# EAGLE design BaseMachine_Sequencer_UI (EAGLE 7.2.0)
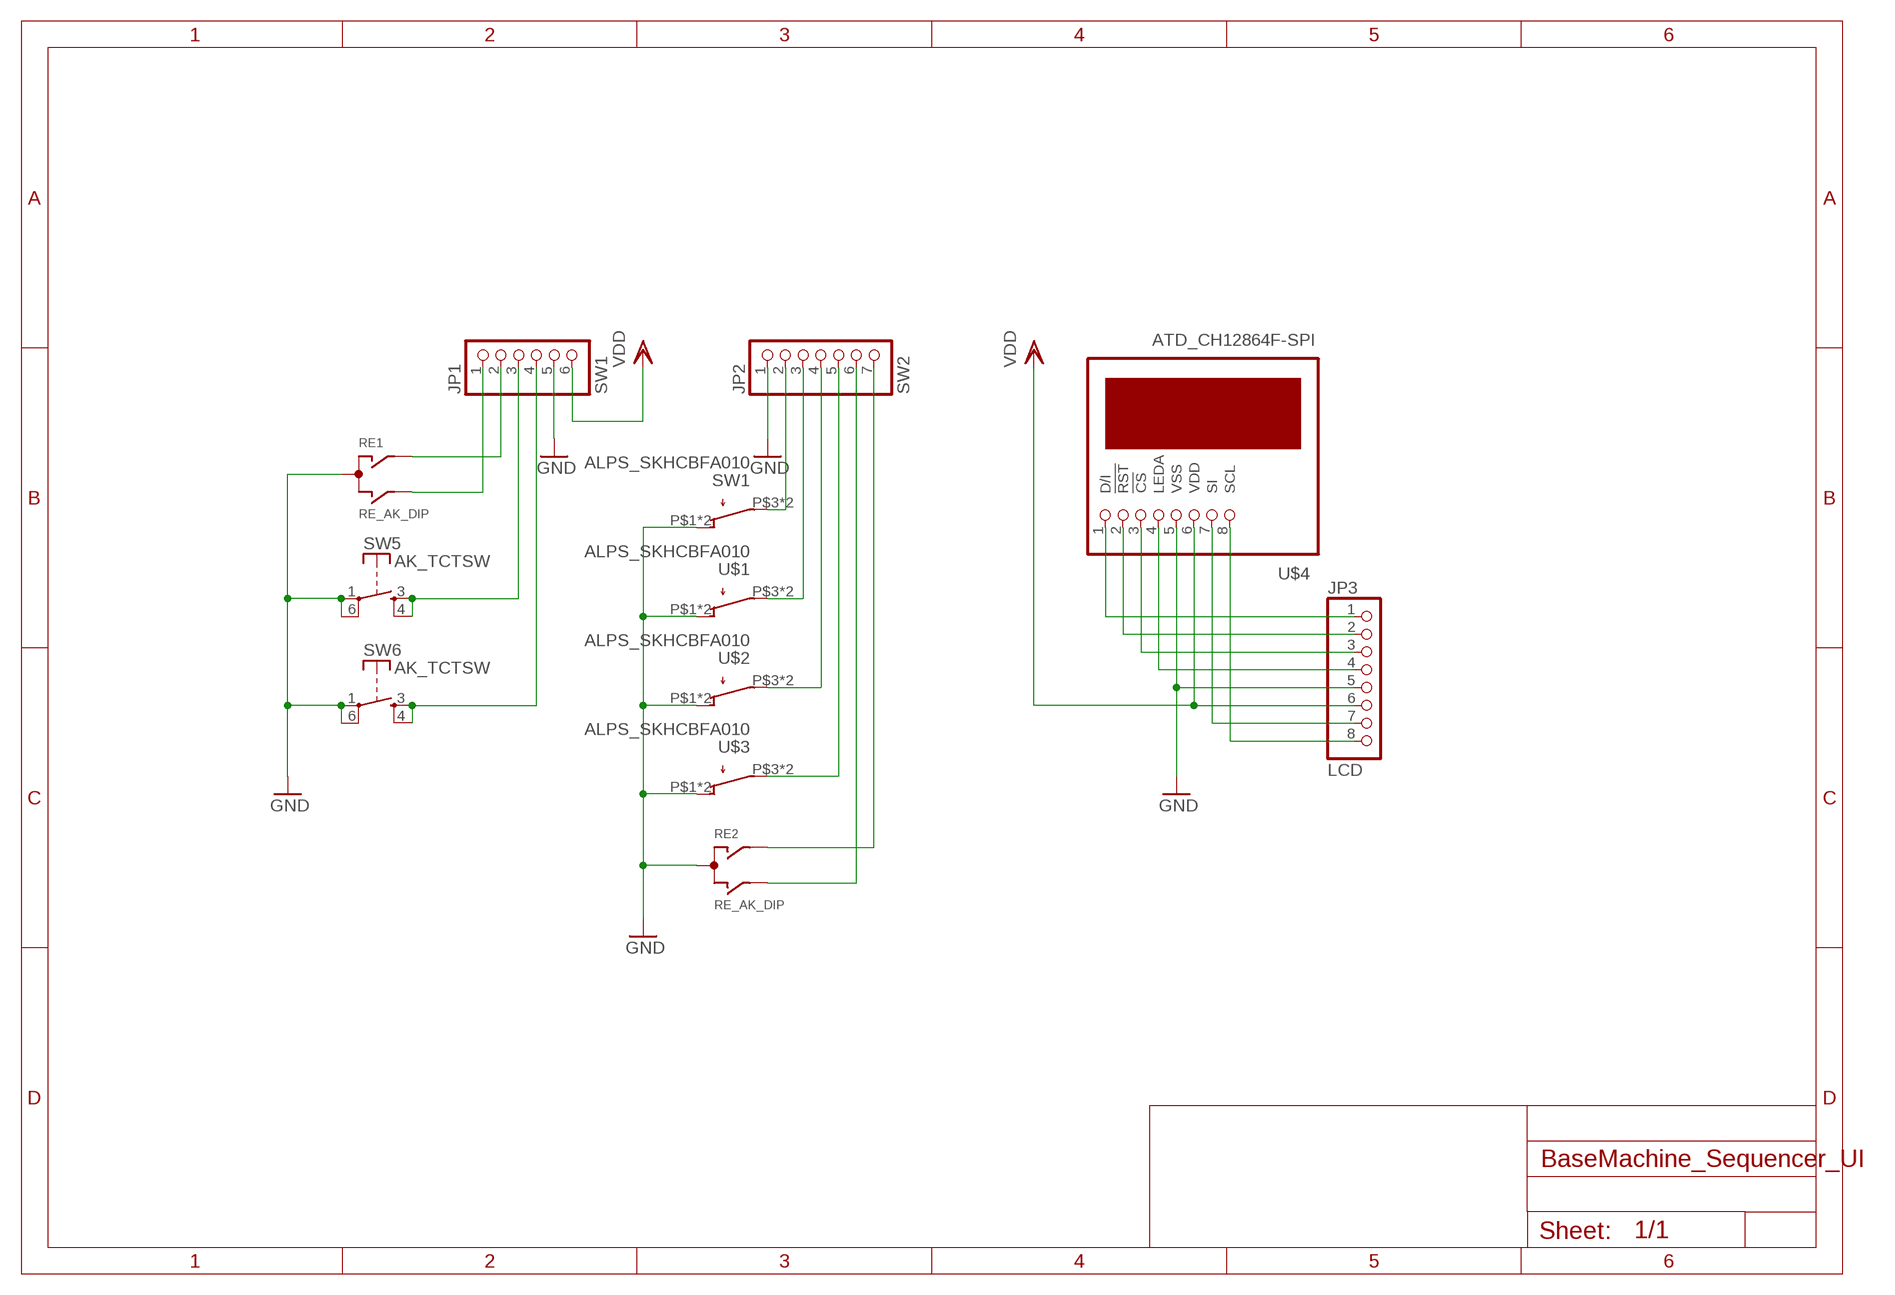
[diagram p0: schematic, sheet 1]

## Parts
JP1  SW1  PINHD-1X6/90  [1X06/90]
JP2  SW2  PINHD-1X7/90  [1X07/90]
JP3  LCD  PINHD-1X8/90  [1X08/90]
RE1  RE_AK_DIP  [RE_AK_DIP]
RE2  RE_AK_DIP  [RE_AK_DIP]
SW1  ALPS_SKHCBFA010  [ALPS_SKHCBFA010]
SW5  AK_TCTSW  [TME1]
SW6  AK_TCTSW  [TME1]
U$1  ALPS_SKHCBFA010  [ALPS_SKHCBFA010]
U$2  ALPS_SKHCBFA010  [ALPS_SKHCBFA010]
U$3  ALPS_SKHCBFA010  [ALPS_SKHCBFA010]
U$4  ATD_CH12864F-SPI  [ATD-CH12864F-SPI]

## Nets
GND: JP1.5 JP2.1 JP3.5 RE1.P$3(C) RE2.P$3(C) SW1.P$1(O) SW1.P$2(O) SW5.1(P) SW5.6(P) SW6.1(P) SW6.6(P) U$1.P$1(O) U$1.P$2(O) U$2.P$1(O) U$2.P$2(O) U$3.P$1(O) U$3.P$2(O) U$4.5(VSS)
LCD1: JP3.1 U$4.1(D/I)
N$2: JP2.4 U$2.P$3(P) U$2.P$4(P)
N$3: JP2.7 RE2.P$2(A)
N$4: JP2.2 SW1.P$3(P) SW1.P$4(P)
N$5: JP3.3 U$4.3(!CS)
N$6: JP2.3 U$1.P$3(P) U$1.P$4(P)
N$7: JP2.6 RE2.P$4(B)
N$8: JP2.5 U$3.P$3(P) U$3.P$4(P)
N$9: JP3.4 U$4.4(LEDA)
N$10: JP1.1 RE1.P$4(B)
N$12: JP1.3 SW5.3(S) SW5.4(S)
N$13: JP1.2 RE1.P$2(A)
N$17: JP3.2 U$4.2(!RST)
N$19: JP1.4 SW6.3(S) SW6.4(S)
N$22: JP3.7 U$4.7(SI)
N$23: JP3.8 U$4.8(SCL)
VDD: JP1.6 JP3.6 U$4.6(VDD)

## Library data of the parts
JP1 = pinhead:PINHD-1X6: PIN HEADER
JP2 = pinhead:PINHD-1X7: PIN HEADER
JP3 = pinhead:PINHD-1X8: PIN HEADER
RE1 RE2 = mylib2:RE_AK_DIP: 秋月 Rotary Encoder DIP化
SW1 U$1-U$3 = mylib2:ALPS_SKHCBFA010: ALPS Tact SW 12mm
SW5 SW6 = mylib2:AK_TCTSW
U$4 = mylib2:ATD_CH12864F-SPI

## Board
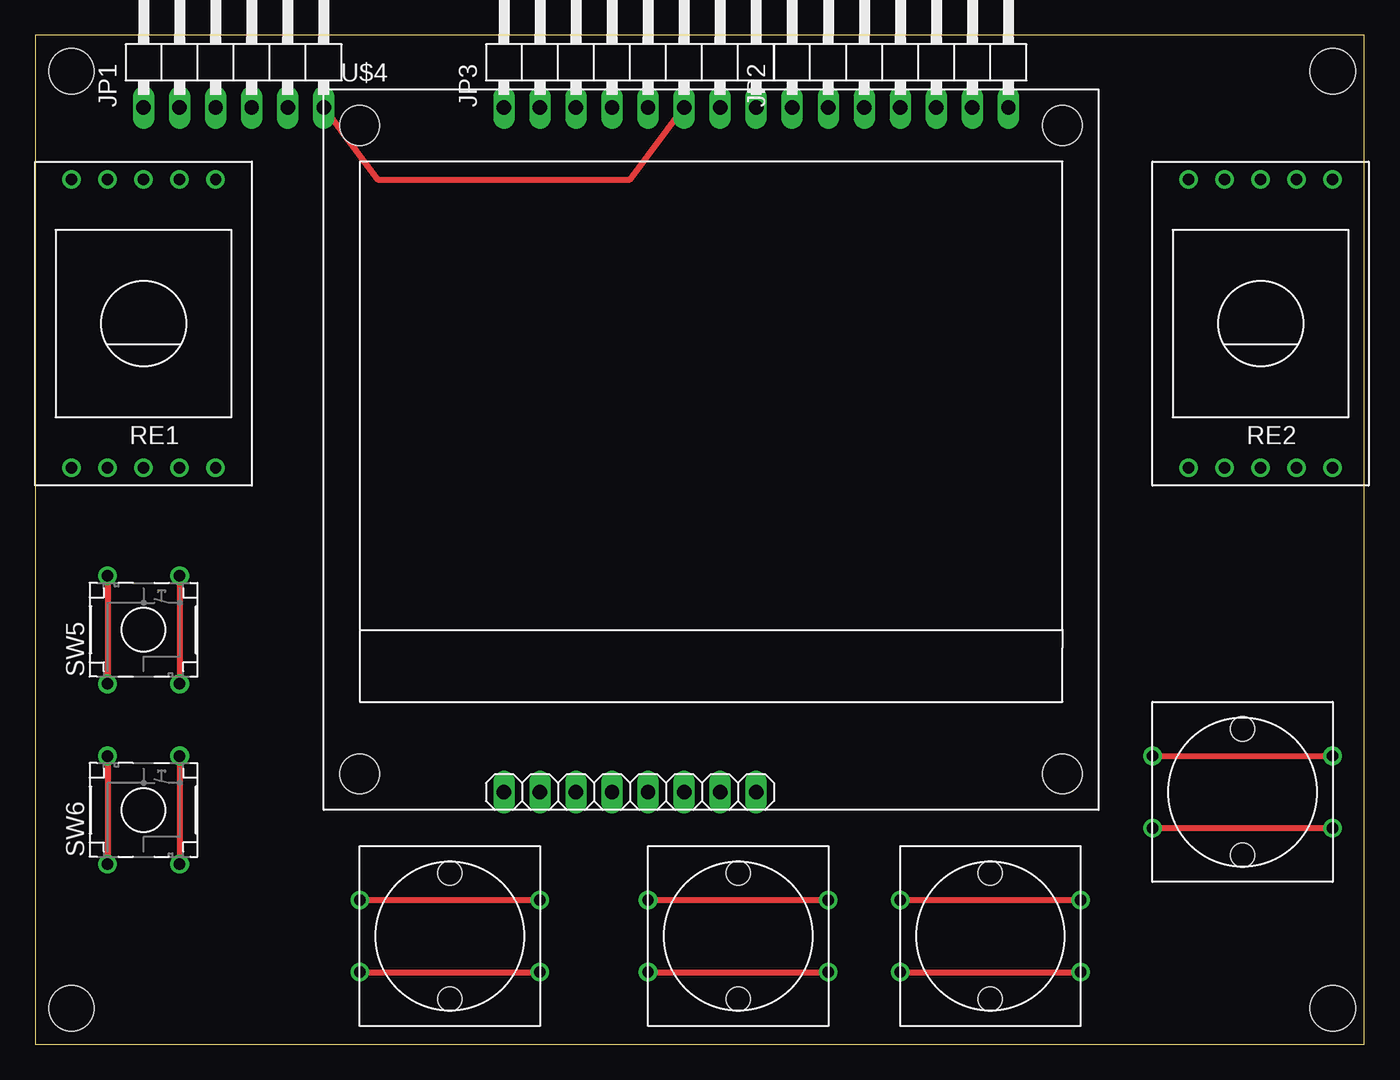
[diagram p1: board, top side]
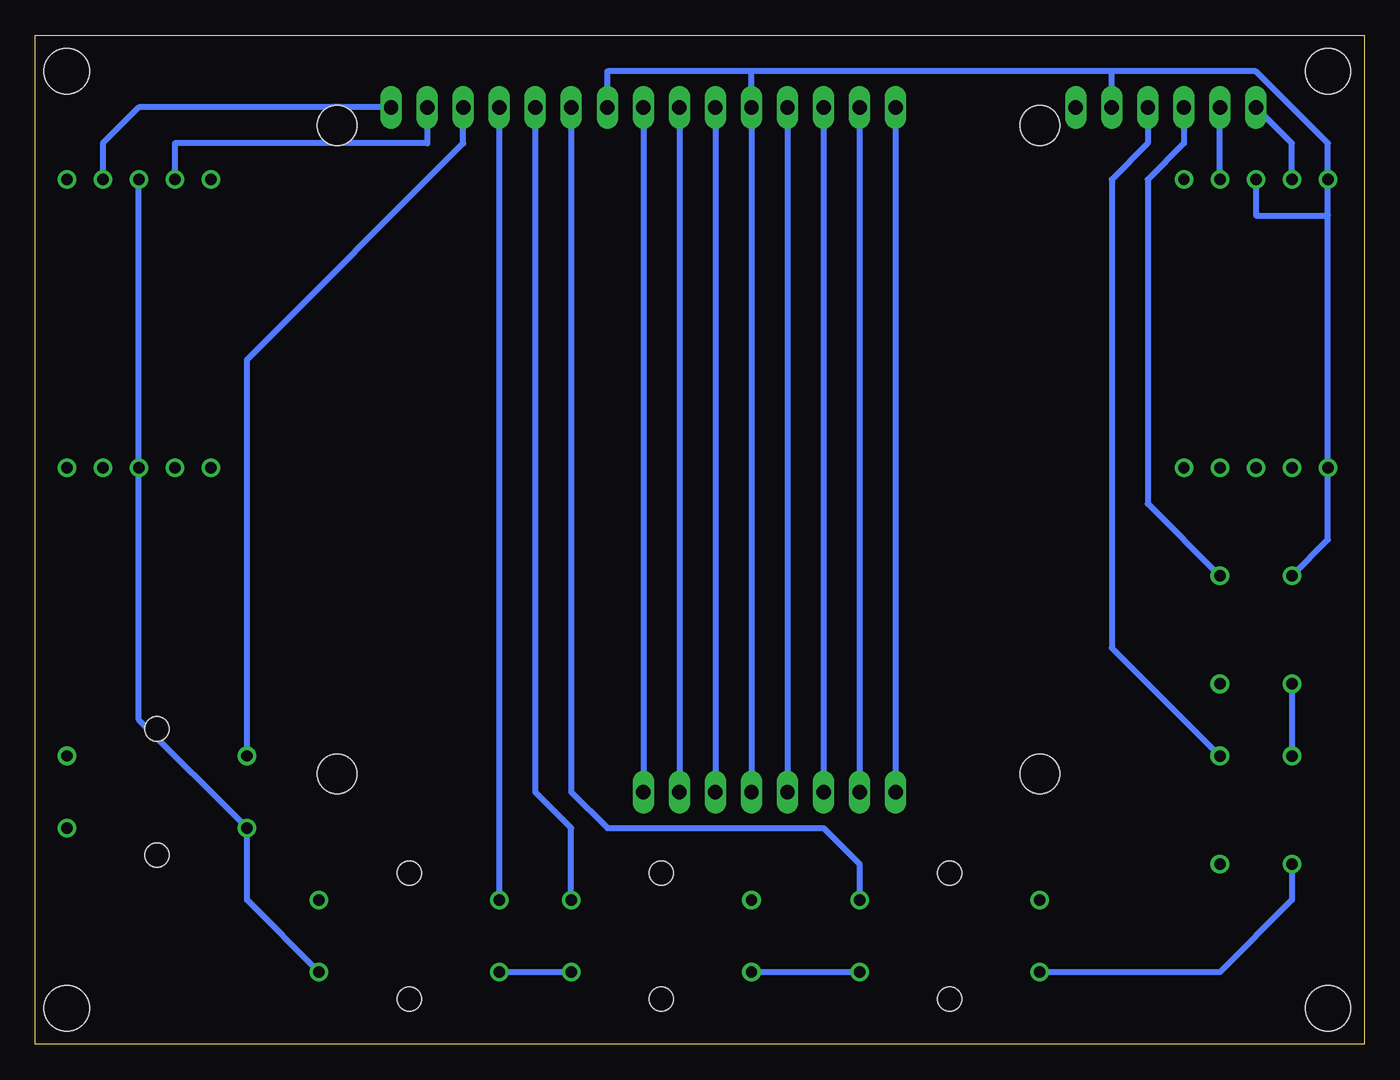
[diagram p2: board, bottom side, seen from below]

Size 93.65 x 71.11 mm. Coordinates in mm from the lower left corner, seen from the top.
Outline: 0,0 93.65,0 93.65,71.11 0,71.11 0,0
Copper layers (1*16): Top 0.035mm / dielectric 1.5mm / Bottom 0.035mm
Design rules "default": minimum track width 10mil, minimum drill 24mil, track to track 8mil, track to pad 8mil, pad to pad 8mil, via to via 8mil, smd to smd 8mil, copper to edge 40mil, drill to drill 8mil, minimum pad ring 10mil, minimum via ring 8mil, stop-mask expansion 4mil, vias tented up to drill 0mil, thermal gap 10mil
Holes 3.2 mm at 2.54,2.54 2.54,68.58 91.44,68.58 91.44,2.54

### Footprints (pad centres in the part's own frame; a part is rotated, then mirrored left to right if it is on the bottom)
1X06/90 = drill 1.016 long: 1 -6.35,-3.81; 2 -3.81,-3.81; 3 -1.27,-3.81; 4 1.27,-3.81; 5 3.81,-3.81; 6 6.35,-3.81
1X07/90 = drill 1.016 long: 1 -7.62,-3.81; 2 -5.08,-3.81; 3 -2.54,-3.81; 4 0,-3.81; 5 2.54,-3.81; 6 5.08,-3.81; 7 7.62,-3.81
1X08/90 = drill 1.016 long: 1 -8.89,-3.81; 2 -6.35,-3.81; 3 -3.81,-3.81; 4 -1.27,-3.81; 5 1.27,-3.81; 6 3.81,-3.81; 7 6.35,-3.81; 8 8.89,-3.81
RE_AK_DIP = drill 0.8: P$1 -5.08,-10.16; P$2 -2.54,-10.16; P$3 0,-10.16; P$4 2.54,-10.16; P$5 5.08,-10.16; P$6 -5.08,10.16; P$7 -2.54,10.16; P$8 0,10.16; P$9 2.54,10.16; P$10 5.08,10.16
ALPS_SKHCBFA010 = drill 0.8: P$1 -6.35,2.54; P$2 6.35,2.54; P$3 -6.35,-2.54; P$4 6.35,-2.54 | hole 1.7: 0,4.445; 0,-4.445
TME1 = drill 0.813: 1 -2.54,-3.81; 3 2.54,-3.81; 4 2.54,3.81; 6 -2.54,3.81
ATD-CH12864F-SPI = drill 1.016 long: 1 12.7,1.27; 2 15.24,1.27; 3 17.78,1.27; 4 20.32,1.27; 5 22.86,1.27; 6 25.4,1.27; 7 27.94,1.27; 8 30.48,1.27 | hole 2.8: 2.54,2.54; 52.07,2.54; 2.54,48.26; 52.07,48.26

### Placement (x,y rotation side)
JP1  13.97,69.85 0 top
JP2  60.96,69.85 0 top
JP3  41.91,69.85 0 top
RE1  7.62,50.8 180 top
RE2  86.36,50.8 180 top
SW1  29.21,7.62 180 top
SW5  7.62,29.21 0 top
SW6  7.62,16.51 0 top
U$1  49.53,7.62 180 top
U$2  67.31,7.62 180 top
U$3  85.09,17.78 180 top
U$4  20.32,16.51 0 top

### Tracks (layer width: path | path; a pad name or v marks a point on that pad's centre or on a via)
GND
  Top 0.406: SW1.P$2 SW1.P$1 | U$1.P$2 U$1.P$1 | U$2.P$2 U$2.P$1 | U$3.P$2 U$3.P$1 | SW6.6 SW6.1 | SW5.6 SW5.1
  Bottom 0.406: SW5.1 SW6.6 | SW6.1 5.08,10.16 10.16,5.08 SW1.P$2 | SW1.P$1 U$1.P$2 | U$1.P$1 U$2.P$2 | RE1.P$3 7.62,58.42 2.54,58.42 | 2.54,58.42 2.54,63.5 7.62,68.58 17.78,68.58 | 17.78,68.58 43.18,68.58 | 43.18,68.58 53.34,68.58 JP2.1 | RE2.P$3 86.36,22.86 U$3.P$2 78.74,10.16 U$2.P$1 | SW5.6 2.54,35.56 2.54,58.42 | JP1.5 17.78,68.58 | U$4.5 JP3.5 43.18,68.58
LCD1
  Bottom 0.406: JP3.1 U$4.1
N$2
  Top 0.406: U$2.P$4 U$2.P$3
  Bottom 0.406: JP2.4 U$2.P$4
N$3
  Bottom 0.406: JP2.7 86.36,66.04 88.9,63.5 RE2.P$2
N$4
  Top 0.406: SW1.P$4 SW1.P$3
  Bottom 0.406: SW1.P$3 35.56,12.7 38.1,15.24 53.34,15.24 55.88,17.78 JP2.2
N$5
  Bottom 0.406: JP3.3 U$4.3
N$6
  Top 0.406: U$1.P$4 U$1.P$3
  Bottom 0.406: U$1.P$3 55.88,15.24 58.42,17.78 JP2.3
N$7
  Bottom 0.406: JP2.6 66.04,63.5 83.82,63.5 RE2.P$4
N$8
  Top 0.406: U$3.P$4 U$3.P$3
  Bottom 0.406: U$3.P$4 78.74,48.26 63.5,63.5 JP2.5
N$9
  Bottom 0.406: JP3.4 U$4.4
N$10
  Bottom 0.406: RE1.P$4 5.08,63.5 JP1.1
N$12
  Top 0.406: SW5.4 SW5.3
  Bottom 0.406: SW5.4 15.24,38.1 15.24,60.96 12.7,63.5 JP1.3
N$13
  Bottom 0.406: RE1.P$2 JP1.2
N$17
  Bottom 0.406: JP3.2 U$4.2
N$19
  Top 0.406: SW6.4 SW6.3
  Bottom 0.406: SW6.4 17.78,27.94 17.78,60.96 15.24,63.5 JP1.4
N$22
  Bottom 0.406: JP3.7 U$4.7
N$23
  Bottom 0.406: JP3.8 U$4.8
VDD
  Top 0.406: JP1.6 24.13,60.96 41.91,60.96 JP3.6
  Bottom 0.406: JP3.6 U$4.6

### Text on the board
tDocu: VDDのジャンパは未実装